# EasyEDA schematic SCH_ESP32-v1_2025-11-17.json
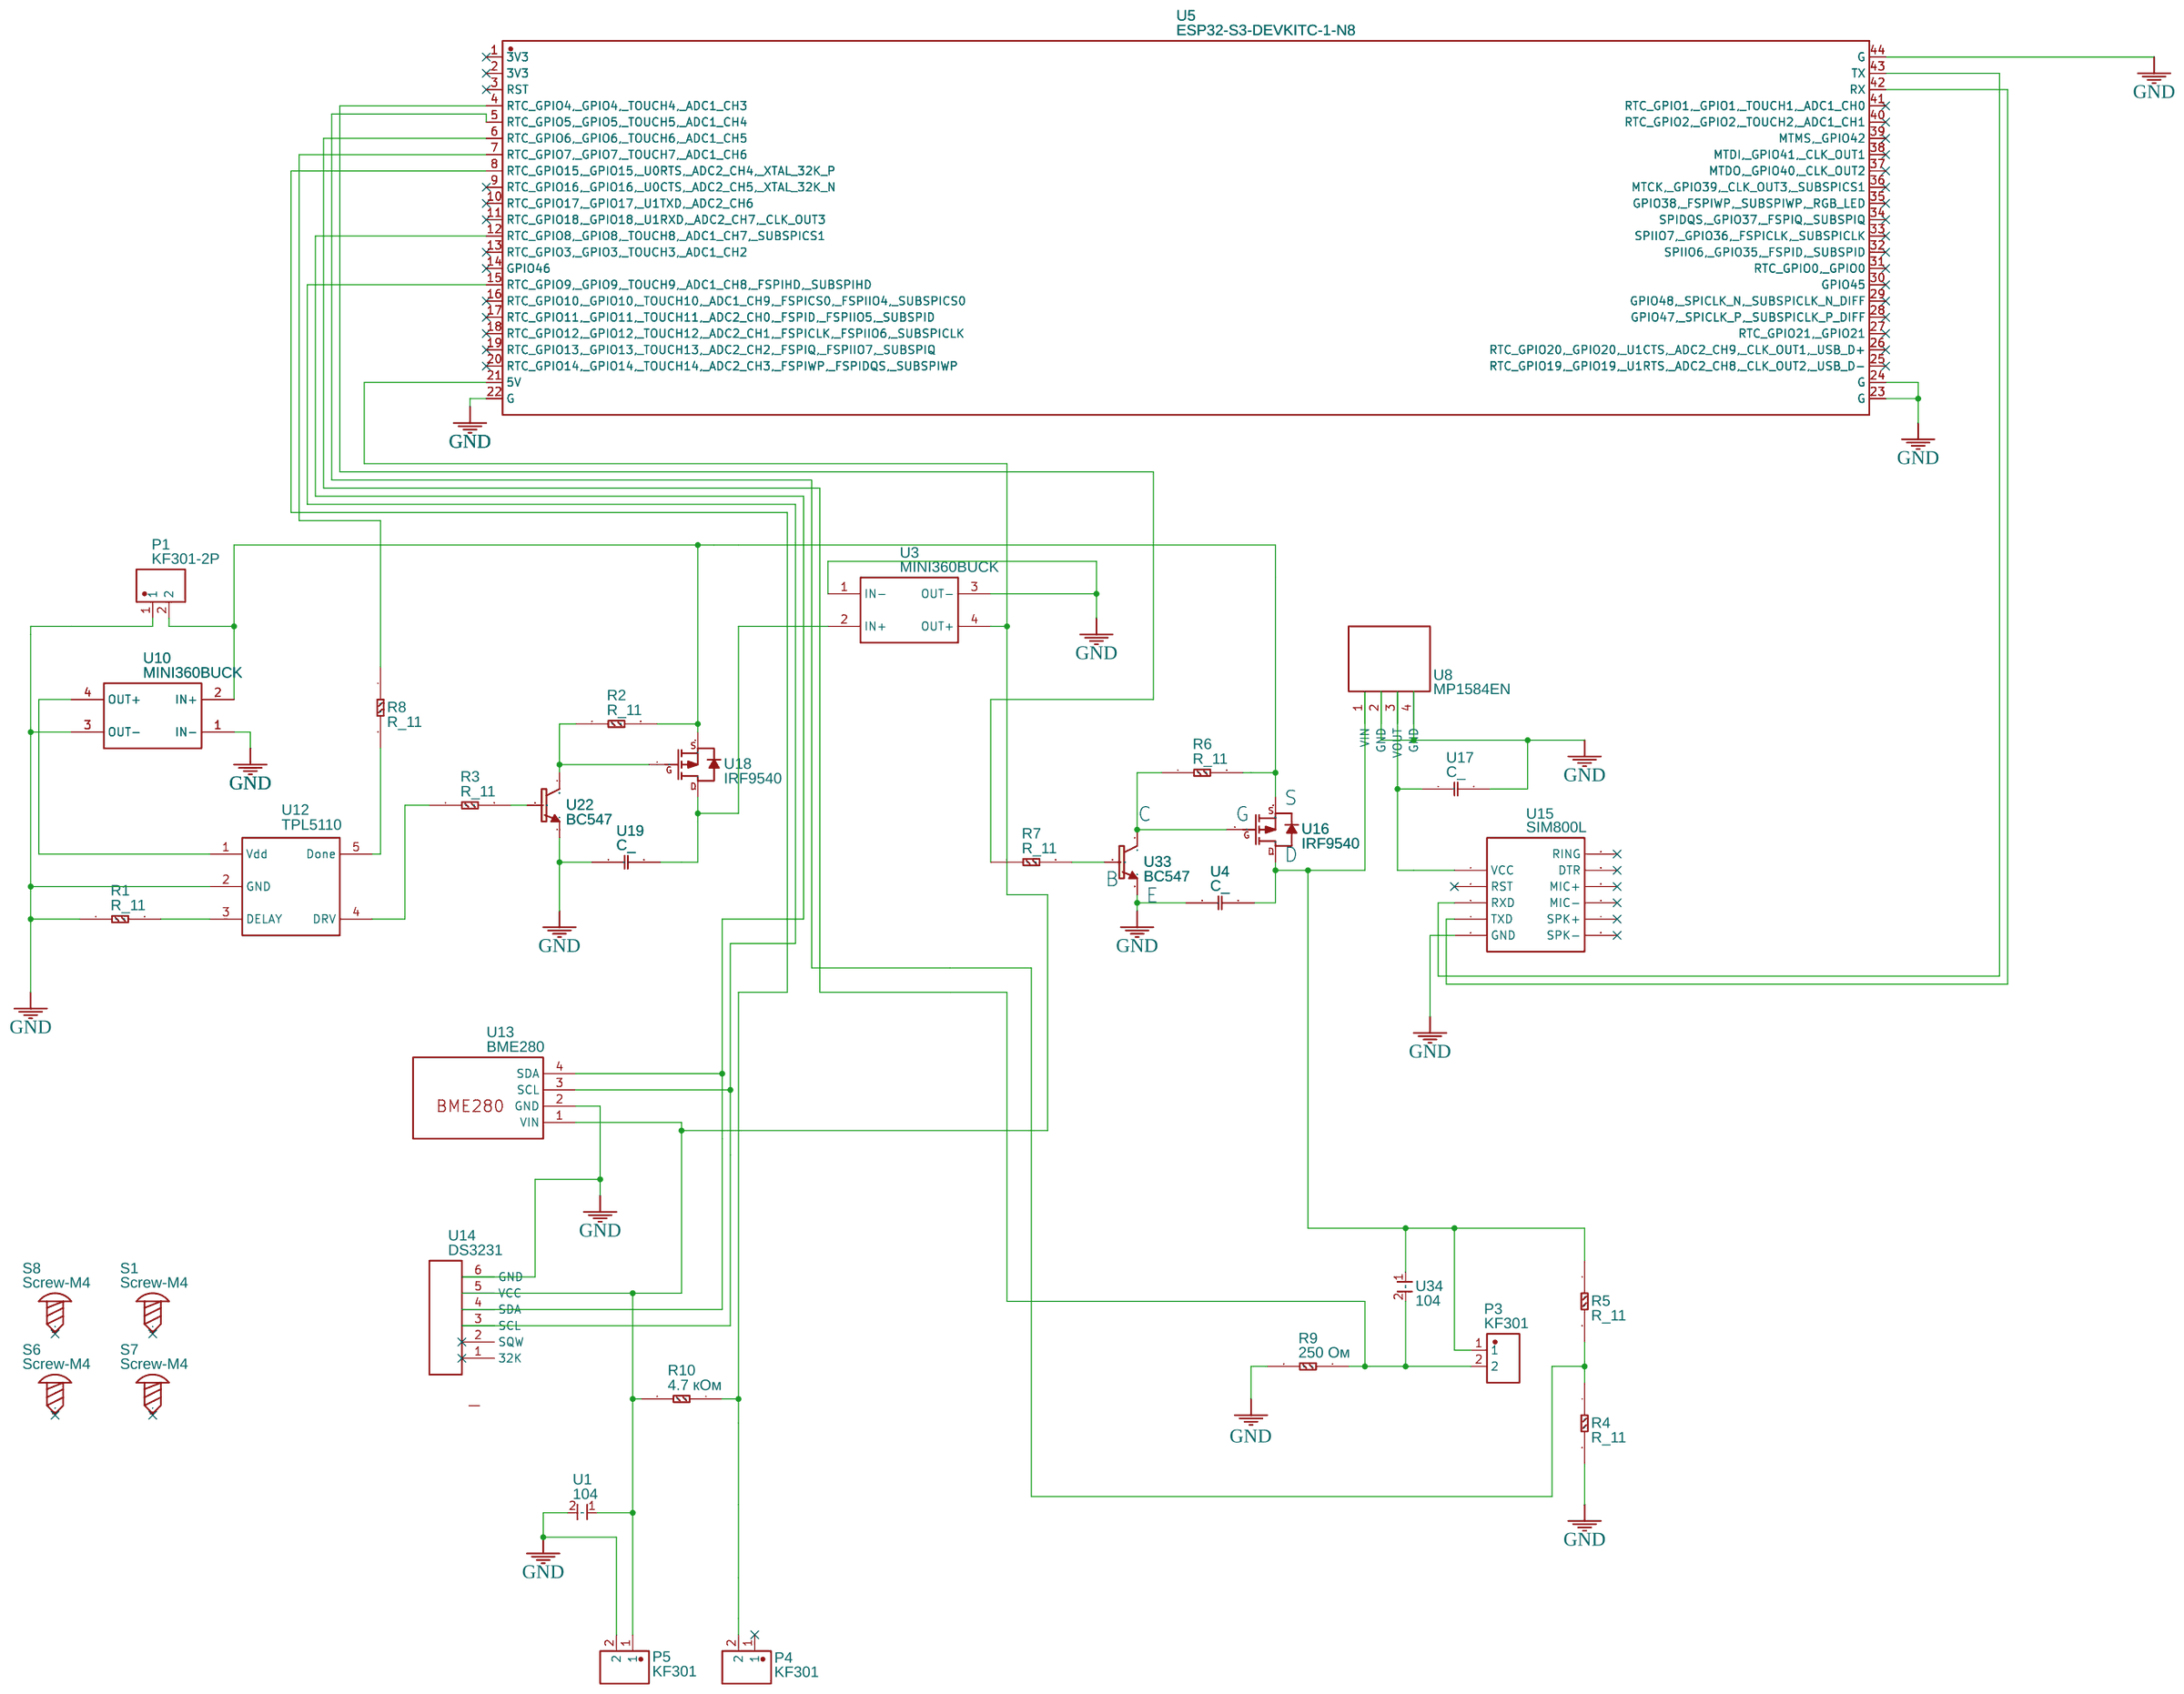
[diagram p0: schematic sheet]

## Parts
P1  KF301-2P  [CONN-TH_XY301V-A-5.0-2P]
P3  KF301  [CONN-TH_XY301V-A-5.0-2P]
P4  KF301  [CONN-TH_XY301V-A-5.0-2P]
P5  KF301  [CONN-TH_XY301V-A-5.0-2P]
R1  R_11  [R_0_125]
R2  R_11  [R_0_125]
R3  R_11  [R_0_125]
R4  R_11  [R_0_125]
R5  R_11  [R_0_125]
R6  R_11  [R_0_125]
R7  R_11  [R_0_125]
R8  R_11  [R_0_125]
R9  250 Ом  [R_0_125]
R10  4.7 кОм  [R_0_125]
S1  Screw-M4  [SCREW-M4]
S6  Screw-M4  [SCREW-M4]
S7  Screw-M4  [SCREW-M4]
S8  Screw-M4  [SCREW-M4]
U1  104  [104]
U3  MINI360BUCK  [MINI360BUCK]
U4  C_  [C_]
U5  ESP32-S3-DEVKITC-1-N8  [CONN-TH_ESP32-S3-DEVKITC-1U-N8]
U8  MP1584EN  [MP1584EN]
U10  MINI360BUCK  [MINI360BUCK]
U12  TPL5110  [TPL5110]
U13  BME280  [BME280]
U14  DS3231  [DS3231]
U15  SIM800L  [SIM800L]
U16  IRF9540  [IRF9540]
U17  C_  [C_]
U18  IRF9540  [IRF9540]
U19  C_  [C_]
U22  BC547  [BC547 (2)]
U33  BC547  [BC547 (2)]
U34  104  [104]

## Library data of the parts
P1 P3-P5 = KF301-2P VCC Y GND: Contributor: lcsc; Supplier: LCSC; Supplier Part: C9900016950; Manufacturer: null; Manufacturer Part: KF301-2P接线端子; JLCPCB Part Class: Extended Part
R1-R10 = R_: Contributor: verdenum
S1 S6-S8 = Screw-M4: Contributor: EasyEDA
U1 U34 = 104: Manufacturer: Fe; Contributor: Guest
U3 U10 = MINI360BUCK: Contributor: Andrey Fedorov; sourceId: FRLFXR8qI; Manufacturer Part: Mini360; link: http://ali.pub/399f0z
U4 U17 U19 = C_: Contributor: verdenum
U5 = ESP32-S3-DEVKITC-1-N8: Supplier: LCSC; Supplier Part: C20438410; Manufacturer: ESPRESSIF(乐鑫); JLCPCB Part Class: Extended Part; Contributor: lcsc
U8 = MP1584EN: Contributor: babeinlovexd
U12 = ADAFRUIT TPL5110 BREAKOUT: Manufacturer Part: 3435; Supplier Part: 3435; Supplier: Adafruit; link: https://learn.adafruit.com/adafruit-tpl5110-power-timer-breakout?view=all; Contributor: Sdobout
U13 = BME280: Contributor: allvex
U14 = DS3231 upright: Contributor: poljak1141leonardo
U15 = SIM800L: Contributor: Rafa_2122
U16 U18 = IRF9540: Contributor: alesmo
U22 U33 = BC547: Contributor: joaodahlke

## Nets
GND: P1.1 P5.2 R1.1 R4.2 R9.2 U1.2 U3.1(IN-) U3.3(OUT-) U4.1 U5.22(G) U5.23(G) U5.24(G) U5.44(G) U8.2(GND) U8.4(GND) U10.1(IN-) U10.3(OUT-) U12.2(GND) U13.2(GND) U14.6(GND) U15.5(GND) U17.2 U19.1 U22.3(E) U33.3(E)
Net-(P1-2): P1.2 R2.2 R6.2 U10.2(IN+) U16.3(S) U18.3(S)
Net-(P3-1): P3.1 R5.1 U4.2 U8.1(VIN) U16.2(D) U34.1
Net-(P3-2): P3.2 R9.1 U5.6(RTC_GPIO6, GPIO6, TOUCH6, ADC1_CH5) U34.2
Net-(P4-2): P4.2 R10.1 U5.8(RTC_GPIO15, GPIO15, U0RTS, ADC2_CH4, XTAL_32K_P)
Net-(P5-1): P5.1 R10.2 U1.1 U3.4(OUT+) U5.21(5V) U13.1(VIN) U14.5(VCC)
Net-(R1-2): R1.2 U12.3(DELAY)
Net-(R2-1): R2.1 U18.1(G) U22.1(C)
Net-(R3-1): R3.1 U12.4(DRV)
Net-(R3-2): R3.2 U22.2(B)
Net-(R4-1): R4.1 R5.2 U5.5(RTC_GPIO5, GPIO5, TOUCH5, ADC1_CH4)
Net-(R6-1): R6.1 U16.1(G) U33.1(C)
Net-(R7-1): R7.1 U5.4(RTC_GPIO4, GPIO4, TOUCH4, ADC1_CH3)
Net-(R7-2): R7.2 U33.2(B)
Net-(R8-1): R8.1 U5.7(RTC_GPIO7, GPIO7, TOUCH7, ADC1_CH6)
Net-(R8-2): R8.2 U12.5(Done)
Net-(U3-2): U3.2(IN+) U18.2(D) U19.2
Net-(U5-12): U5.12(RTC_GPIO8, GPIO8, TOUCH8, ADC1_CH7, SUBSPICS1) U13.4(SDA) U14.4(SDA)
Net-(U5-15): U5.15(RTC_GPIO9, GPIO9, TOUCH9, ADC1_CH8, FSPIHD, SUBSPIHD) U13.3(SCL) U14.3(SCL)
Net-(U5-42): U5.42(RX) U15.4(TXD)
Net-(U5-43): U5.43(TX) U15.3(RXD)
Net-(U8-3): U8.3(VOUT) U15.1(VCC) U17.1
Net-(U10-4): U10.4(OUT+) U12.1(Vdd)

Not connected (* = marked no-connect by the designer): P4 1*; S1 1*; S6 1*; S7 1*; S8 1*; U5 1(3V3)* 2(3V3)* 3(RST)* 9(RTC_GPIO16, GPIO16, U0CTS, ADC2_CH5, XTAL_32K_N)* 10(RTC_GPIO17, GPIO17, U1TXD, ADC2_CH6)* 11(RTC_GPIO18, GPIO18, U1RXD, ADC2_CH7, CLK_OUT3)* 13(RTC_GPIO3, GPIO3, TOUCH3, ADC1_CH2)* 14(GPIO46)* 16(RTC_GPIO10, GPIO10, TOUCH10, ADC1_CH9, FSPICS0, FSPIIO4, SUBSPICS0)* 17(RTC_GPIO11, GPIO11, TOUCH11, ADC2_CH0, FSPID, FSPIIO5, SUBSPID)* 18(RTC_GPIO12, GPIO12, TOUCH12, ADC2_CH1, FSPICLK, FSPIIO6, SUBSPICLK)* 19(RTC_GPIO13, GPIO13, TOUCH13, ADC2_CH2, FSPIQ, FSPIIO7, SUBSPIQ)* 20(RTC_GPIO14, GPIO14, TOUCH14, ADC2_CH3, FSPIWP, FSPIDQS, SUBSPIWP)* 25(RTC_GPIO19, GPIO19, U1RTS, ADC2_CH8, CLK_OUT2, USB_D-)* 26(RTC_GPIO20, GPIO20, U1CTS, ADC2_CH9, CLK_OUT1, USB_D+)* 27(RTC_GPIO21, GPIO21)* 28(GPIO47, SPICLK_P, SUBSPICLK_P_DIFF)* 29(GPIO48, SPICLK_N, SUBSPICLK_N_DIFF)* 30(GPIO45)* 31(RTC_GPIO0, GPIO0)* 32(SPIIO6, GPIO35, FSPID, SUBSPID)* 33(SPIIO7, GPIO36, FSPICLK, SUBSPICLK)* 34(SPIDQS, GPIO37, FSPIQ, SUBSPIQ)* 35(GPIO38, FSPIWP, SUBSPIWP, RGB LED)* 36(MTCK, GPIO39, CLK_OUT3, SUBSPICS1)* 37(MTDO, GPIO40, CLK_OUT2)* 38(MTDI, GPIO41, CLK_OUT1)* 39(MTMS, GPIO42)* 40(RTC_GPIO2, GPIO2, TOUCH2, ADC1_CH1)* 41(RTC_GPIO1, GPIO1, TOUCH1, ADC1_CH0)*; U14 1(32K)* 2(SQW)*; U15 2(RST)* 6(SPK-)* 7(SPK+)* 8(MIC-)* 9(MIC+)* 10(DTR)* 11(RING)*

## Notes on the sheet
- S
- C
- G
- D
- B
- E
